# EAGLE schematic octanis_eps_v2 (EAGLE 7.2.0)
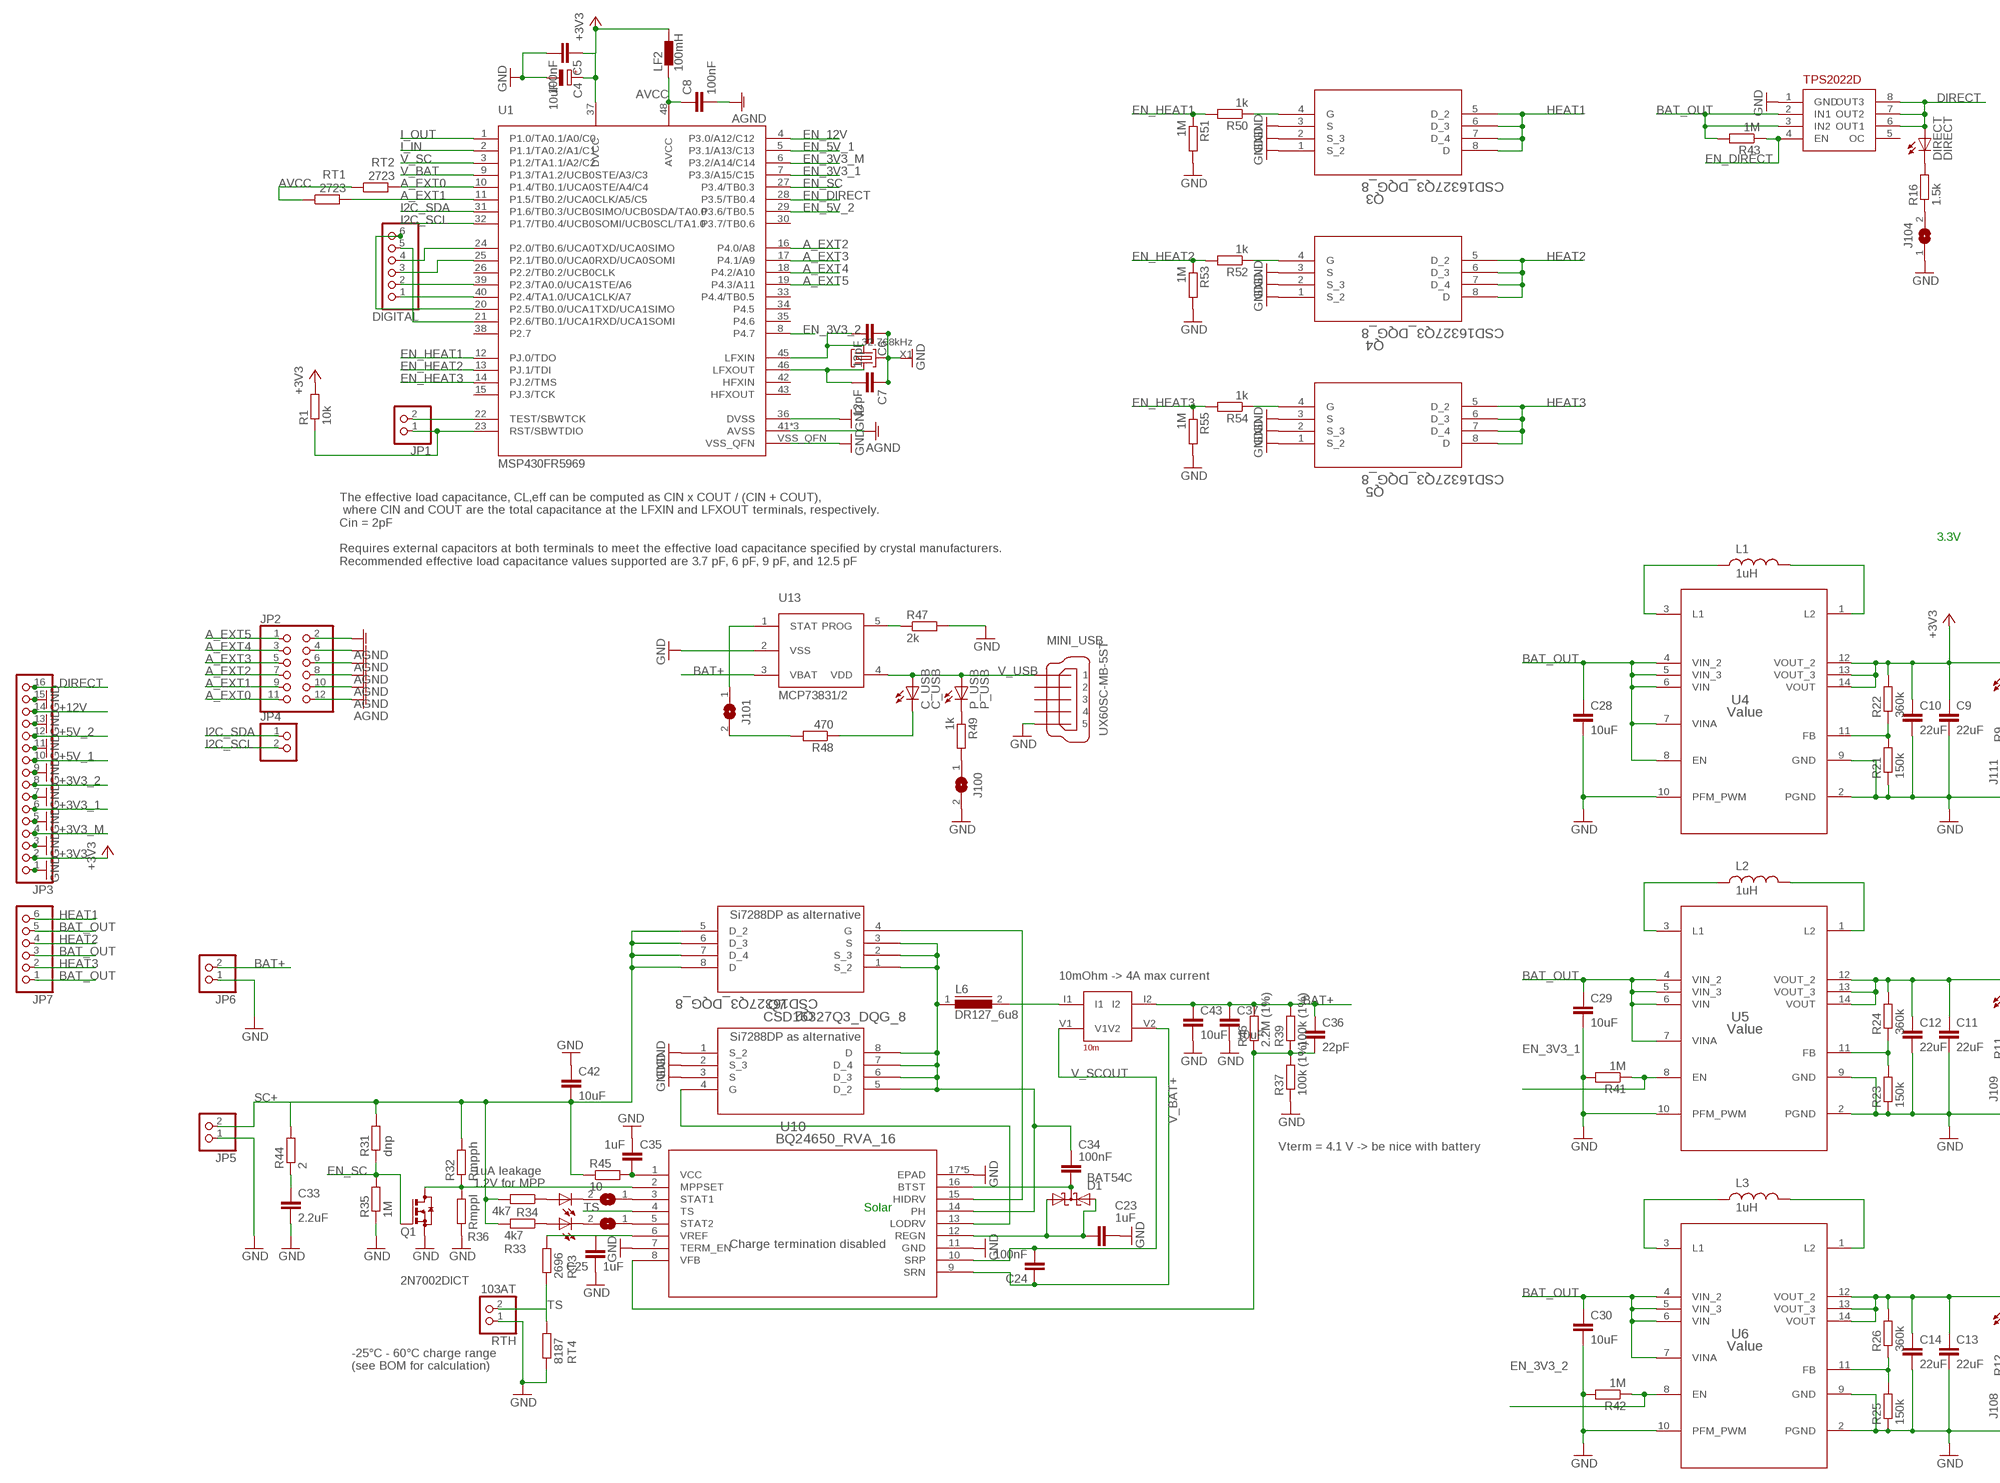
[diagram p0: schematic, sheet 1, part 1 of 2]
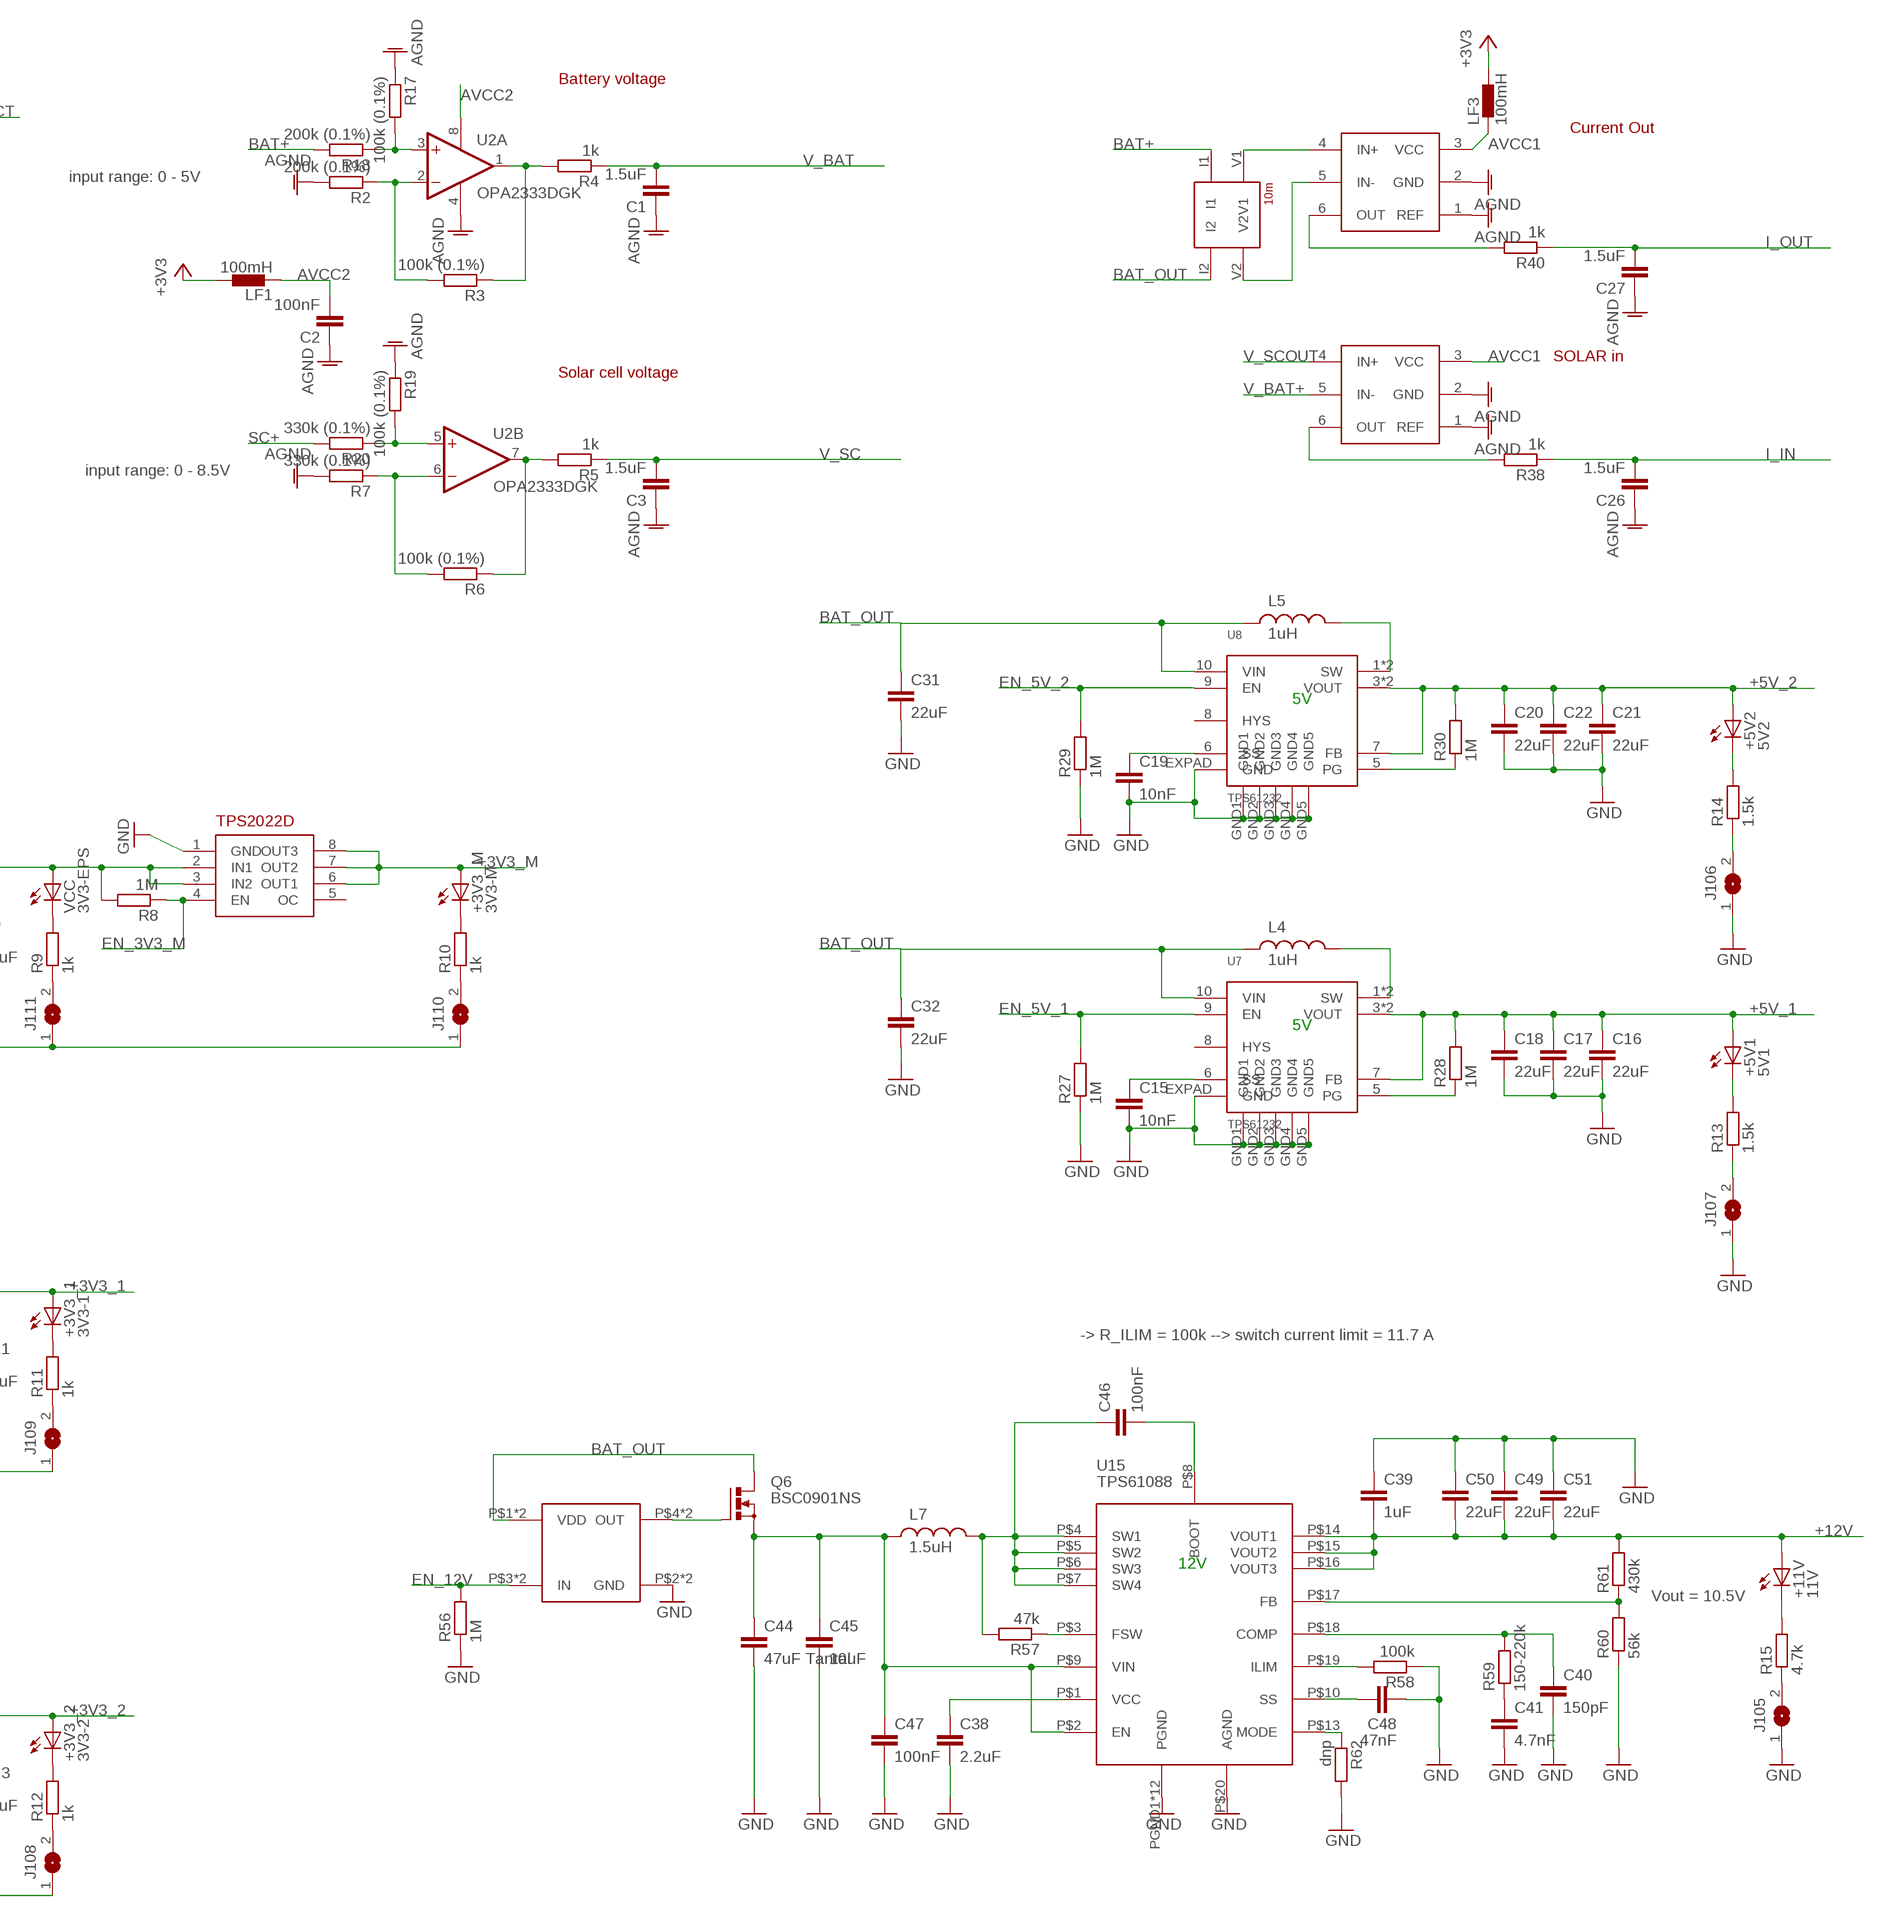
[diagram p1: schematic, sheet 1, part 2 of 2]

## Parts
+3V3_1  3V3-1  LEDCHIPLED_0603  [CHIPLED_0603]
+3V3_2  3V3-2  LEDCHIPLED_0603  [CHIPLED_0603]
+3V3_M  3V3-M  LEDCHIPLED_0603  [CHIPLED_0603]
+5V1  5V1  LEDCHIPLED_0603  [CHIPLED_0603]
+5V2  5V2  LEDCHIPLED_0603  [CHIPLED_0603]
+11V  11V  LEDCHIPLED_0603  [CHIPLED_0603]
C1  1.5uF  C-EUC0603  [C0603]
C2  100nF  C-EUC0603  [C0603]
C3  1.5uF  C-EUC0603  [C0603]
C4  10uF  CPOL-EUA/3216-18R  [A/3216-18R]
C5  100nF  C-EUC0603  [C0603]
C6  12pF  C-EUC0603  [C0603]
C7  12pF  C-EUC0603  [C0603]
C8  100nF  C-EUC0603  [C0603]
C9  22uF  C-EUC0805  [C0805]
C10  22uF  C-EUC0805  [C0805]
C11  22uF  C-EUC0805  [C0805]
C12  22uF  C-EUC0805  [C0805]
C13  22uF  C-EUC0805  [C0805]
C14  22uF  C-EUC0805  [C0805]
C15  10nF  C-EUC0603  [C0603]
C16  22uF  C-EUC0805  [C0805]
C17  22uF  C-EUC0805  [C0805]
C18  22uF  C-EUC0805  [C0805]
C19  10nF  C-EUC0603  [C0603]
C20  22uF  C-EUC0805  [C0805]
C21  22uF  C-EUC0805  [C0805]
C22  22uF  C-EUC0805  [C0805]
C23  1uF  C-EUC0603  [C0603]
C24  100nF  C-EUC0603  [C0603]
C25  1uF  C-EUC0603  [C0603]
C26  1.5uF  C-EUC0603  [C0603]
C27  1.5uF  C-EUC0603  [C0603]
C28  10uF  C-EUC0805  [C0805]
C29  10uF  C-EUC0805  [C0805]
C30  10uF  C-EUC0805  [C0805]
C31  22uF  C-EUC0805  [C0805]
C32  22uF  C-EUC0805  [C0805]
C33  2.2uF  C-EUC0603  [C0603]
C34  100nF  C-EUC0603  [C0603]
C35  1uF  C-EUC0603  [C0603]
C36  22pF  C-EUC0603  [C0603]
C37  10uF  C-EUC0805  [C0805]
C38  2.2uF  C-EUC0603  [C0603]
C39  1uF  C-EUC0603  [C0603]
C40  150pF  C-EUC0603  [C0603]
C41  4.7nF  C-EUC0603  [C0603]
C42  10uF  C-EUC0805  [C0805]
C43  10uF  C-EUC0805  [C0805]
C44  47uF Tantal  C-EUC1210  [C1210]
C45  10uF  C-EUC0805  [C0805]
C46  100nF  C-EUC0603  [C0603]
C47  100nF  C-EUC0603  [C0603]
C48  47nF  C-EUC0603  [C0603]
C49  22uF  C-EUC0805  [C0805]
C50  22uF  C-EUC0805  [C0805]
C51  22uF  C-EUC0805  [C0805]
C_USB  C_USB  LEDCHIPLED_0603  [CHIPLED_0603]
D1  BAT54C  [SOT23]
DIGITAL  PINHD-1X6B  [1X06-BIG]
DIRECT  DIRECT  LEDCHIPLED_0603  [CHIPLED_0603]
J100  SJ  [SJ]
J101  SJ  [SJ]
J102  SJ  [SJ]
J103  SJ  [SJ]
J104  SJ  [SJ]
J105  SJ  [SJ]
J106  SJ  [SJ]
J107  SJ  [SJ]
J108  SJ  [SJ]
J109  SJ  [SJ]
J110  SJ  [SJ]
J111  SJ  [SJ]
JP1  PINHD-1X2  [1X02]
JP2  PINHD-2X6  [2X06]
JP3  PINHD-1X16  [1X16]
JP4  PINHD-1X2  [1X02]
JP5  PINHD-1X2  [1X02]
JP6  PINHD-1X2  [1X02]
JP7  PINHD-1X6  [1X06]
L1  1uH  XFL4020  [XFL4020]
L2  1uH  XFL4020  [XFL4020]
L3  1uH  XFL4020  [XFL4020]
L4  1uH  XFL4020  [XFL4020]
L5  1uH  XFL4020  [XFL4020]
L6  DR127_6u8  DR127  [DR127]
L7  1.5uH  XFL4020  [XFL4020]
LF1  100mH  BLM15HD601SN1  [0402]
LF2  100mH  BLM15HD601SN1  [0402]
LF3  100mH  BLM15HD601SN1  [0402]
MINI_USB  UX60SC-MB-5ST  [UX60SC-MB-5ST]
P_USB  P_USB  LEDCHIPLED_0603  [CHIPLED_0603]
Q1  BSS123  [SOT23]
Q2  CSD16327Q3_DQG_8  [DQG8]
Q3  CSD16327Q3_DQG_8  [DQG8]
Q4  CSD16327Q3_DQG_8  [DQG8]
Q5  CSD16327Q3_DQG_8  [DQG8]
Q6  BSC0901NS  BSC340N08NS3G  [PG-TDSON-8]
Q7  CSD16327Q3_DQG_8  [DQG8]
R1  10k  R-EU_R0603  [R0603]
R2  200k (0.1%)  R-EU_R0603  [R0603]
R3  100k (0.1%)  R-EU_R0603  [R0603]
R4  1k  R-EU_R0603  [R0603]
R5  1k  R-EU_R0603  [R0603]
R6  100k (0.1%)  R-EU_R0603  [R0603]
R7  330k (0.1%)  R-EU_R0603  [R0603]
R8  1M  R-EU_R0603  [R0603]
R9  1k  R-EU_R0603  [R0603]
R10  1k  R-EU_R0603  [R0603]
R11  1k  R-EU_R0603  [R0603]
R12  1k  R-EU_R0603  [R0603]
R13  1.5k  R-EU_R0603  [R0603]
R14  1.5k  R-EU_R0603  [R0603]
R15  4.7k  R-EU_R0603  [R0603]
R16  1.5k  R-EU_R0603  [R0603]
R17  100k (0.1%)  R-EU_R0603  [R0603]
R18  200k (0.1%)  R-EU_R0603  [R0603]
R19  100k (0.1%)  R-EU_R0603  [R0603]
R20  330k (0.1%)  R-EU_R0603  [R0603]
R21  150k  R-EU_R0603  [R0603]
R22  360k  R-EU_R0603  [R0603]
R23  150k  R-EU_R0603  [R0603]
R24  360k  R-EU_R0603  [R0603]
R25  150k  R-EU_R0603  [R0603]
R26  360k  R-EU_R0603  [R0603]
R27  1M  R-EU_R0603  [R0603]
R28  1M  R-EU_R0603  [R0603]
R29  1M  R-EU_R0603  [R0603]
R30  1M  R-EU_R0603  [R0603]
R31  dnp  R-EU_R0603  [R0603]
R32  Rmpph  R-EU_R0603  [R0603]
R33  4k7  R-EU_R0603  [R0603]
R34  4k7  R-EU_R0603  [R0603]
R35  1M  R-EU_R0603  [R0603]
R36  Rmppl  R-EU_R0603  [R0603]
R37  100k (1%)  R-EU_R0603  [R0603]
R38  1k  R-EU_R0603  [R0603]
R39  100k (1%)  R-EU_R0603  [R0603]
R40  1k  R-EU_R0603  [R0603]
R41  1M  R-EU_R0603  [R0603]
R42  1M  R-EU_R0603  [R0603]
R43  1M  R-EU_R0603  [R0603]
R44  2  R-EU_R2010  [R2010]
R45  10  R-EU_R1206  [R1206]
R46  2.2M (1%)  R-EU_R0603  [R0603]
R47  2k  R-EU_R0603  [R0603]
R48  470  R-EU_R0603  [R0603]
R49  1k  R-EU_R0603  [R0603]
R50  1k  R-EU_R0603  [R0603]
R51  1M  R-EU_R0603  [R0603]
R52  1k  R-EU_R0603  [R0603]
R53  1M  R-EU_R0603  [R0603]
R54  1k  R-EU_R0603  [R0603]
R55  1M  R-EU_R0603  [R0603]
R56  1M  R-EU_R0603  [R0603]
R57  47k  R-EU_R0603  [R0603]
R58  100k  R-EU_R0603  [R0603]
R59  150-220k  R-EU_R0603  [R0603]
R60  56k  R-EU_R0603  [R0603]
R61  430k  R-EU_R0603  [R0603]
R62  dnp  R-EU_R0603  [R0603]
RS1  10m  CURRENT_RESISTOR  [4PADS_RESISTOR]
RS2  10m  CURRENT_RESISTOR  [4PADS_RESISTOR]
RT1  2723  R-EU_R0603  [R0603]
RT2  2723  R-EU_R0603  [R0603]
RT3  2696  R-EU_R0603  [R0603]
RT4  8187  R-EU_R0603  [R0603]
RTH  103AT  PINHD-1X2  [1X02]
STAT1  5V-ok  LEDCHIPLED_0603  [CHIPLED_0603]
STAT2  5V-ok  LEDCHIPLED_0603  [CHIPLED_0603]
U1  MSP430FR5969  [S-PVQFN-N48]
U2  OPA2333DGK  [MSOP08]
U3  TPS2022D  [SO8]
U4  Value  TPS630250RNCR  [RNC0014A]
U5  Value  TPS630250RNCR  [RNC0014A]
U6  Value  TPS630250RNCR  [RNC0014A]
U7  TPS61232  [S-PVSON-N10]
U8  TPS61232  [S-PVSON-N10]
U9  TPS2022D  [SO8]
U10  BQ24650_RVA_16  [RVA16_2P14X2P14]
U11  INA213  [SC70-6]
U12  INA213  [SC70-6]
U13  MCP73831/2  [SOT23-5]
U14  MIC5019  [QFN-4]
U15  TPS61088  [R-PVQFN-N20]
VCC  3V3-EPS  LEDCHIPLED_0603  [CHIPLED_0603]
X1  32.768kHz  MS3V-T1R  [MS3V-T1R]

## Nets
+3V3: C4.+ C5.1 C9.1 C10.1 JP3.2 LF1.2 LF2.2 LF3.2 R1.2 R8.2 R22.2 U1.37(DVCC) U3.2(IN1) U3.3(IN2) U4.12(VOUT_2) U4.13(VOUT_3) U4.14(VOUT) VCC.A
+3V3_1: +3V3_1.A C11.1 C12.1 JP3.6 R24.2 U5.12(VOUT_2) U5.13(VOUT_3) U5.14(VOUT)
+3V3_2: +3V3_2.A C13.1 C14.1 JP3.8 R26.2 U6.12(VOUT_2) U6.13(VOUT_3) U6.14(VOUT)
+3V3_M: +3V3_M.A JP3.4 U3.6(OUT1) U3.7(OUT2) U3.8(OUT3)
+5V_1 [fine]: +5V1.A C16.1 C17.1 C18.1 JP3.10 R28.2 U7.3(VOUT) U7.4(VOUT) U7.7(FB)
+5V_2: +5V2.A C20.1 C21.1 C22.1 JP3.12 R30.2 U8.3(VOUT) U8.4(VOUT) U8.7(FB)
+12V [fine]: +11V.A C39.2 C49.2 C50.2 C51.2 JP3.14 R61.2 U15.P$14(VOUT1) U15.P$15(VOUT2) U15.P$16(VOUT3)
A_EXT0: JP2.11 RT2.2 U1.10(P1.4/TB0.1/UCA0STE/A4/C4)
A_EXT1: JP2.9 RT1.2 U1.11(P1.5/TB0.2/UCA0CLK/A5/C5)
A_EXT2: JP2.7 U1.16(P4.0/A8)
A_EXT3: JP2.5 U1.17(P4.1/A9)
A_EXT4: JP2.3 U1.18(P4.2/A10)
A_EXT5: JP2.1 U1.19(P4.3/A11)
AGND: C1.1 C2.1 C3.1 C8.2 C26.1 C27.1 JP2.2 JP2.4 JP2.6 JP2.8 JP2.10 JP2.12 R2.2 R7.2 R17.1 R19.1 U1.41(AVSS) U1.44(AVSS) U1.47(AVSS) U2.4(P:V-) U11.1(REF) U11.2(GND) U12.1(REF) U12.2(GND)
AVCC: C8.1 LF2.1 RT1.1 RT2.1 U1.48(AVCC)
AVCC1: LF3.1 U11.3(VCC) U12.3(VCC)
AVCC2: C2.2 LF1.1 U2.8(P:V+)
BAT+: C36.1 C37.1 C43.1 JP6.2 R18.2 R39.2 R46.2 RS1.I1 RS2.I2 U13.3(VBAT)
BAT_11V: C44.1 C45.1 C47.1 L7.P$1 Q6.1(S) Q6.2(S) Q6.3(S) U15.P$2(EN) U15.P$9(VIN)
BAT_OUT: C28.1 C29.1 C30.1 C31.1 C32.1 JP7.1 JP7.3 JP7.5 L4.P$1 L5.P$1 Q6.5(D) Q6.6(D) Q6.7(D) Q6.8(D) R43.2 RS1.I2 U4.4(VIN_2) U4.5(VIN_3) U4.6(VIN) U4.7(VINA) U4.8(EN) U5.4(VIN_2) U5.5(VIN_3) U5.6(VIN) U5.7(VINA) U6.4(VIN_2) U6.5(VIN_3) U6.6(VIN) U6.7(VINA) U7.10(VIN) U8.10(VIN) U9.2(IN1) U9.3(IN2) U14.P1(VDD) U14.P$1(VDD)
DIRECT: DIRECT.A JP3.16 U9.6(OUT1) U9.7(OUT2) U9.8(OUT3)
EN_3V3_1: R41.1 U1.7(P3.3/A15/C15) U5.8(EN)
EN_3V3_2: R42.1 U1.8(P4.7) U6.8(EN)
EN_3V3_M: R8.1 U1.6(P3.2/A14/C14) U3.4(EN)
EN_5V_1: R27.2 U1.5(P3.1/A13/C13) U7.9(EN)
EN_5V_2: R29.2 U1.29(P3.6/TB0.5) U8.9(EN)
EN_12V: R56.2 U1.4(P3.0/A12/C12) U14.P3(IN) U14.P$3(IN)
EN_DIRECT: R43.1 U1.28(P3.5/TB0.4) U9.4(EN)
EN_HEAT1: R50.2 R51.1 U1.12(PJ.0/TDO)
EN_HEAT2: R52.2 R53.1 U1.13(PJ.1/TDI)
EN_HEAT3: R54.2 R55.1 U1.14(PJ.2/TMS)
EN_SC: Q1.1(G) R31.1 R35.2 U1.27(P3.4/TB0.3)
GND [power]: C4.- C5.2 C6.1 C7.1 C9.2 C10.2 C11.2 C12.2 C13.2 C14.2 C15.2 C16.2 C17.2 C18.2 C19.2 C20.2 C21.2 C22.2 C23.2 C25.2 C28.2 C29.2 C30.2 C31.2 C32.2 C33.2 C35.2 C37.2 C38.2 C39.1 C40.2 C41.2 C42.1 C43.2 C44.2 C45.2 C47.2 C48.2 C49.1 C50.1 C51.1 J100.2 J104.1 J105.1 J106.1 J107.1 J108.1 J109.1 J110.1 J111.1 JP3.1 JP3.3 JP3.5 JP3.7 JP3.9 JP3.11 JP3.13 JP3.15 JP5.1 JP6.1 MINI_USB.5 Q1.2(S) Q3.1(S_2) Q3.2(S_3) Q3.3(S) Q4.1(S_2) Q4.2(S_3) Q4.3(S) Q5.1(S_2) Q5.2(S_3) Q5.3(S) Q7.1(S_2) Q7.2(S_3) Q7.3(S) R21.1 R23.1 R25.1 R27.1 R29.1 R35.1 R36.1 R37.1 R41.2 R42.2 R47.2 R51.2 R53.2 R55.2 R56.1 R58.1 R60.1 R62.2 RT4.2 RTH.1 U1.36(DVSS) U1.VSS_QFN U3.1(GND) U4.2(PGND) U4.9(GND) U4.10(PFM_PWM) U5.2(PGND) U5.9(GND) U5.10(PFM_PWM) U6.2(PGND) U6.9(GND) U6.10(PFM_PWM) U7.EXPAD(GND) U7.GND1 U7.GND2 U7.GND3 U7.GND4 U7.GND5 U8.EXPAD(GND) U8.GND1 U8.GND2 U8.GND3 U8.GND4 U8.GND5 U9.1(GND) U10.7(TERM_EN) U10.11(GND) U10.17(EPAD) U10.V(EPAD) U10.V_1(EPAD) U10.V_2(EPAD) U10.V_3(EPAD) U13.2(VSS) U14.P2(GND) U14.P$2(GND) U15.P$20(AGND) U15.PGND1(PGND) U15.PGND2(PGND) U15.PGND3(PGND) U15.PGND4(PGND) U15.PGND5(PGND) U15.PGND6(PGND) U15.PGND7(PGND) U15.PGND8(PGND) U15.PGND9(PGND) U15.PGND10(PGND) U15.PGND11(PGND) U15.PGND12(PGND) X1.P3(GND)
HEAT1: JP7.6 Q3.5(D_2) Q3.6(D_3) Q3.7(D_4) Q3.8(D)
HEAT2: JP7.4 Q4.5(D_2) Q4.6(D_3) Q4.7(D_4) Q4.8(D)
HEAT3: JP7.2 Q5.5(D_2) Q5.6(D_3) Q5.7(D_4) Q5.8(D)
I2C_SCL: JP4.2 U1.32(P1.7/TB0.4/UCB0SOMI/UCB0SCL/TA1.0)
I2C_SDA: JP4.1 U1.31(P1.6/TB0.3/UCB0SIMO/UCB0SDA/TA0.0)
I_IN: C26.2 R38.1 U1.2(P1.1/TA0.2/A1/C1)
I_OUT: C27.2 R40.1 U1.1(P1.0/TA0.1/A0/C0)
IND: L4.P$2 U7.1(SW) U7.2(SW)
IND1: L5.P$2 U8.1(SW) U8.2(SW)
LED1: +5V2.C R14.2
LED2: DIRECT.C R16.2
LED5: +5V1.C R13.2
N$1: L1.P$1 U4.3(L1)
N$2: R28.1 U7.5(PG)
N$3: L1.P$2 U4.1(L2)
N$4: L6.2 RS2.I1
N$5: C15.1 U7.6(SS)
N$6: L2.P$1 U5.3(L1)
N$7: L2.P$2 U5.1(L2)
N$9: R62.1 U15.P$13(MODE)
N$10: Q6.4(G) U14.P4(OUT) U14.P$4(OUT)
N$11: L3.P$1 U6.3(L1)
N$12: L3.P$2 U6.1(L2)
N$13: JP1.1 R1.1 U1.23(RST/SBWTDIO)
N$14: J107.2 R13.1
N$15: JP1.2 U1.22(TEST/SBWTCK)
N$16: C7.2 U1.46(LFXOUT) X1.P1
N$17: C6.2 U1.45(LFXIN) X1.P2
N$18: DIGITAL.3 U1.25(P2.1/TB0.0/UCA0RXD/UCA0SOMI)
N$19: R3.1 R4.2 U2.1(A:OUT)
N$20: R2.1 R3.2 U2.2(A:-IN)
N$21: R17.2 R18.1 U2.3(A:+IN)
N$22: R5.2 R6.1 U2.7(B:OUT)
N$23: R6.2 R7.1 U2.6(B:-IN)
N$24: R19.2 R20.1 U2.5(B:+IN)
N$25: R40.2 U11.6(OUT)
N$26: R38.2 U12.6(OUT)
N$27: Q5.4(G) R54.1
N$28: DIGITAL.4 U1.24(P2.0/TB0.6/UCA0TXD/UCA0SIMO)
N$29: DIGITAL.2 U1.39(P2.3/TA0.0/UCA1STE/A6)
N$30: DIGITAL.1 U1.40(P2.4/TA1.0/UCA1CLK/A7)
N$31: Q4.4(G) R52.1
N$32: RS1.V1 U11.4(IN+)
N$33: RS1.V2 U11.5(IN-)
N$34: R21.2 R22.1 U4.11(FB)
N$35: R23.2 R24.1 U5.11(FB)
N$36: DIGITAL.5 U1.21(P2.6/TB0.1/UCA1RXD/UCA1SOMI)
N$37: Q3.4(G) R50.1
N$38: C46.2 U15.P$8(BOOT)
N$39: +3V3_M.C R10.2
N$40: J110.2 R10.1
N$41: DIGITAL.6 U1.20(P2.5/TB0.0/UCA1TXD/UCA1SIMO)
N$42: C33.1 R44.1
N$43: R9.2 VCC.C
N$44: R30.1 U8.5(PG)
N$45: J111.2 R9.1
N$46: +3V3_2.C R12.2
N$47: J108.2 R12.1
N$48: +11V.C R15.2
N$49: J105.2 R15.1
N$50: C46.1 L7.P$2 R57.2 U15.P$4(SW1) U15.P$5(SW2) U15.P$6(SW3) U15.P$7(SW4)
N$51: +3V3_1.C R11.2
N$52: J109.2 R11.1
N$53: R57.1 U15.P$3(FSW)
N$54: C41.1 R59.1
N$55: J106.2 R14.1
N$56: C48.1 U15.P$10(SS)
N$57: R58.2 U15.P$19(ILIM)
N$58: C40.1 R59.2 U15.P$18(COMP)
N$59: C38.1 U15.P$1(VCC)
N$60: R60.2 R61.1 U15.P$17(FB)
N$61: C19.1 U8.6(SS)
N$62: R25.2 R26.1 U6.11(FB)
N$63: R47.1 U13.5(PROG)
N$64: Q1.3(D) R32.1 R36.2 U10.2(MPPSET)
N$65: J101.1 U13.1(STAT)
N$66: R34.1 STAT2.A
N$67: J103.2 STAT1.C
N$68: J102.2 STAT2.C
N$69: R33.1 STAT1.A
N$70: J103.1 U10.5(STAT2)
N$71: J102.1 U10.3(STAT1)
N$72: C25.1 RT3.1 U10.6(VREF)
N$73: C35.1 R45.2 U10.1(VCC)
N$74: J101.2 R48.2
N$75: C_USB.C R48.1
N$76: C34.1 L6.1 Q2.1(S_2) Q2.2(S_3) Q2.3(S) Q7.5(D_2) Q7.6(D_3) Q7.7(D_4) Q7.8(D) U10.14(PH)
N$77: J104.2 R16.1
N$78: P_USB.C R49.1
N$79: J100.1 R49.2
N$80: Q2.4(G) U10.15(HIDRV)
N$81: Q7.4(G) U10.13(LODRV)
N$82: C36.2 R37.2 R39.1 R46.1 U10.8(VFB)
N$84: C23.1 D1.1(A1) D1.2(A2) U10.12(REGN)
N$85: C34.2 D1.3(CC) U10.16(BTST)
SC+: C42.2 JP5.2 Q2.5(D_2) Q2.6(D_3) Q2.7(D_4) Q2.8(D) R20.2 R31.2 R32.2 R33.2 R34.2 R44.2 R45.1
TS: RT3.2 RT4.1 RTH.2 U10.4(TS)
V_BAT: C1.2 R4.1 U1.9(P1.3/TA1.2/UCB0STE/A3/C3)
V_BAT+: C24.1 RS2.V2 U10.9(SRN) U12.5(IN-)
V_SC: C3.2 R5.1 U1.3(P1.2/TA1.1/A2/C2)
V_SCOUT: C24.2 RS2.V1 U10.10(SRP) U12.4(IN+)
V_USB: C_USB.A MINI_USB.1 P_USB.A U13.4(VDD)
Unconnected: MINI_USB.2 MINI_USB.3 MINI_USB.4 Q6.TH U1.15(PJ.3/TCK) U1.26(P2.2/TB0.2/UCB0CLK) U1.30(P3.7/TB0.6) U1.33(P4.4/TB0.5) U1.34(P4.5) U1.35(P4.6) U1.38(P2.7) U1.42(HFXIN) U1.43(HFXOUT) U3.5(OC) U7.8(HYS) U8.8(HYS) U9.5(OC)

## Notes on the sheet
- Battery voltage
- Current Out
- input range: 0 - 5V
- SOLAR in
- Solar cell voltage
- input range: 0 - 8.5V
- 3.3V | 5V
- The effective load capacitance, CL,eff can be computed as CIN x COUT / (CIN + COUT),
   where CIN and COUT are the total capacitance at the LFXIN and LFXOUT terminals, respectively. 
  Cin = 2pF
  
  Requires external capacitors at both terminals to meet the effective load capacitance specified by crystal manufacturers. 
  Recommended effective load capacitance values supported are 3.7 pF, 6 pF, 9 pF, and 12.5 pF
- 5V
- Si7288DP as alternative
- 10mOhm -> 4A max current
- -> R_ILIM = 100k --> switch current limit = 11.7 A
- Si7288DP as alternative
- Vterm = 4.1 V -> be nice with battery
- 1uA leakage
- 1.2V for MPP | 12V
- Solar | Vout = 10.5V
- Charge termination disabled
- 2N7002DICT
- -25°C - 60°C charge range
  (see BOM for calculation)

## Library data of the parts
+3V3_1 +3V3_2 +3V3_M +5V1 +5V2 +11V C_USB DIRECT P_USB STAT1 STAT2 VCC = adafruit:LED: LED OSRAM: - CHIPLED LG R971, LG N971, LY N971, LG Q971, LY Q971, LO R971, LY R971 LH N974, LH R974 LS Q976, LO Q976, LY Q976 LO Q996 - Hyper CHIPLED LW Q18S LB Q993, LB Q99A, LB R99A - SideLED LS A670, LO A670, LY A670, LG A670, LP A670 LB A673, LV A673, LT A673, LW A673 LH A674 LY A675 LS A676, LA A676, LO A676, LY A676, LW A676 LS A679, LY A679, LG A679 - Hyper Micro SIDELED® LS Y876, LA Y876, LO Y876, LY Y876 LT Y87S - SmartLED LW L88C, LW L88S LB L89C, LB L89S, LG L890 LS L89K, LO L89K, LY L89K LS L896, LA L896, LO L896, LY L896 - TOPLED LS T670, LO T670, LY T670, LG T670, LP T670 LSG T670, LSP T670, LSY T670, LOP T670, LYG T670 LG T671, LOG T671, LSG T671 LB T673, LV T673, LT T673, LW T673 LH T674 LS T676, LA T676, LO T676, LY T676, LB T676, LH T676, LSB T676, LW T676 LB T67C, LV T67C, LT T67C, LS T67K, LO T67K, LY T67K, LW E67C LS E67B, LA E67B, LO E67B, LY E67B, LB E67C, LV E67C, LT E67C LW T67C LS T679, LY T679, LG T679 LS T770, LO T770, LY T770, LG T770, LP T770 LB T773, LV T773, LT T773, LW T773 LH T774 LS E675, LA E675, LY E675, LS T675 LS T776, LA T776, LO T776, LY T776, LB T776 LHGB T686 LT T68C, LB T68C - Hyper Mini TOPLED® LB M676 - Mini TOPLED Santana® LG M470 LS M47K, LO M47K, LY M47K Source: http://www.osram.convergy.de/
C1-C3 C5-C8 C15 C19 C23-C27 C33-C36 C38-C41 C44 C46-C48 = rcl:C-EU: CAPACITOR, European symbol
C4 = rcl:CPOL-EU: POLARIZED CAPACITOR, European symbol
C9-C14 C16-C18 C20-C22 C28-C32 C37 C42 C43 C45 C49-C51 = resistor:C-EU: CAPACITOR, European symbol
D1 = diode:BAT54C: Schottky Diodes Source: Fairchild .. BAT54.pdf
DIGITAL = adafruit:PINHD-1X6: PIN HEADER
J100-J111 = jumper:SJ: SMD solder JUMPER
JP1 JP4-JP6 RTH = Headerlibrary:PINHD-1X2: PIN HEADER
JP2 = Headerlibrary:PINHD-2X6: PIN HEADER
JP3 = Headerlibrary:PINHD-1X16: PIN HEADER
JP7 = Headerlibrary:PINHD-1X6: PIN HEADER
L1-L5 L7 = Coilcraft:XFL4020
L6 = inductors:DR127: High Power Density, High Efficiency, Shielded Inductors Source: coiltronics_dr_series.pdf
LF1-LF3 = inductors:BLM15H: EMIFIL (R) Chip Ferrite Bead for GHz Noise Source: http://www.murata.com/ Ferrite Bead BLM15H.pdf
MINI_USB = usbminib:UX60SC-MB-5ST: Hirose UX60SC-MB-5ST ￼Mini-B Connectors, SMT mount receptacles meeting requirements of USB2.0 Standard UX60S Series Datasheet: e24000153.pdf <http://www.hirose.co.jp/cataloge_hp/e24000153.pdf> [hirose.co.jp]
Q1 = transistor-small-signal:BSS123: N-CHANNEL MOS FET
Q2-Q5 Q7 = texasinstruments:CSD16327Q3_DQG_8; DATASHEETURL: http://www.ti.com/lit/gpn/CSD16327Q3; DESCRIPTION: N-Channel NexFET Power MOSFET; FAMILY_NAME: N-Channel MOSFET Transistors; GENERIC_PART_NUMBER: CSD16327Q3; INDUSTRY_STD_PKG_TYPE: SON; MANUFACTURER: Texas Instruments; PACKAGE_DESIGNATOR: DQG; PIN_COUNT: 8
Q6 = transistor-power:BSC340N08NS3G: OptiMOS TM 3 Power-Transistor BSC340N08NS3 G Source: Data sheet <http://www.infineon.com/dgdl/BSC340N08NS3G_rev2.4.pdf?folderId=db3a304313b8b5a60113cee8763b02d7&fileId=db3a30431add1d95011ae81c21f2563a>
R1-R7 R9-R40 R44-R56 RT1-RT4 = rcl:R-EU_: RESISTOR, European symbol
R8 R41-R43 R57-R62 = resistor:R-EU_: RESISTOR, European symbol
RS1 RS2 = Octanis1_EPS:CURRENT_RESISTOR
U1 = chips:MSP430FR5969
U2 = linear:OPA2333: DUAL 1.8V, microPOWER CMOS OPERATIONAL AMPLIFIERS Zerø-Drift Series Source: Texas Instruments (Burr-Brown) .. U11 opa333 Operational Amp.pdf
U3 U9 = Octanis1_EPS:TPS2022D: TEXAS INSTRUMENTS - TPS2022D - IC, 1.5A PWR DIST SWITCH 8SOIC
U4-U6 = octanis_eps_v05:TPS630250RNCR; ALTERNATEPARTNUMBER: TPS630250RNCT; COMPTYPE: IC; MANUFACTURER: Texas Instruments; MOUNTTYPE: SMT; PACKAGEREFERENCE: RNC0014A; PARTNUMBER: TPS630250RNCR; PIN_COUNT: 14; REFDES: RefDes; TYPE: TYPE
U7 U8 = texasinstruments:TPS61232: Up to 96% Efficiency Synchronous Boost Converter 3.3 V to 5 V Power Conversion with 2.1 A Output Current Input Supply Voltage Supervisor with Adjustable Threshold/ Hysteresis Power Save Mode for Light Load Efficiency Load Disconnect During Shutdown Output Over Voltage Protection Programmable Soft Start Power Good Output Input Voltage Range: 2.3 V to 5.5 V Output Voltage Range: 2.5 V to 5.5 V 2 MHz Switching Frequency Output Capacitor Discharge (TPS61231) 3 mm × 3 mm × 0.9 mm SON Package
U10 = octanis_eps_v05:BQ24650_RVA_16; DATASHEETURL: http://www.ti.com/lit/gpn/BQ24650; DESCRIPTION: High Efficiency Synchronous Switch-Mode Charger Controller ? Solar Battery Charger; FAMILY_NAME: BATTERY CHARGE MANAGEMENT; GENERIC_PART_NUMBER: BQ24650; INDUSTRY_STD_PKG_TYPE: VQFN; MANUFACTURER: Texas Instruments; PACKAGE_DESIGNATOR: RVA; PIN_COUNT: 16
U11 U12 = Octanis1_EPS:INA213: Voltage Output, High or Low Side Measurement, Bi-Directional Zer ø -Drift Series Current-Shunt Monitor
U13 = Octanis1_EPS:MCP73831/2
U14 = Octanis1_EPS:MIC5019
U15 = texasinstruments:TPS61088
X1 = microcrystal:MS3V-T1R

## Net classes
0 default: clearance 0.152 mm
1 power: width 0.203 mm, drill 0.305 mm, clearance 0.152 mm
3 fine: width 0.406 mm, drill 0.61 mm, clearance 0.152 mm